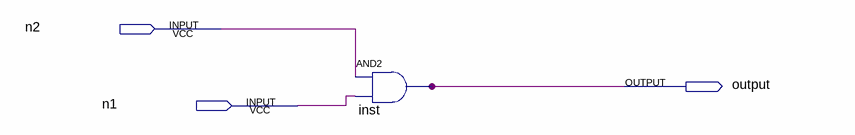
[diagram p0: schematic sheet]
// Quartus schematic GateDemo.bdf as structural Verilog: 1 symbols, 3 pins
module GateDemo (
  input  n2,
  input  n1,
  output \output 
);

  and inst (\output , n2, n1);
endmodule
